# EAGLE schematic prototypeV2.32 (EAGLE 9.5.2)
DESIGNER: Juan J. Rojas / A. Wenzel; INSTITUTION: Kyutech (JP) / TEC (CR) / TUM (DE); PROJECT_NAME: BDC_Prototype; VERSION: 2.3
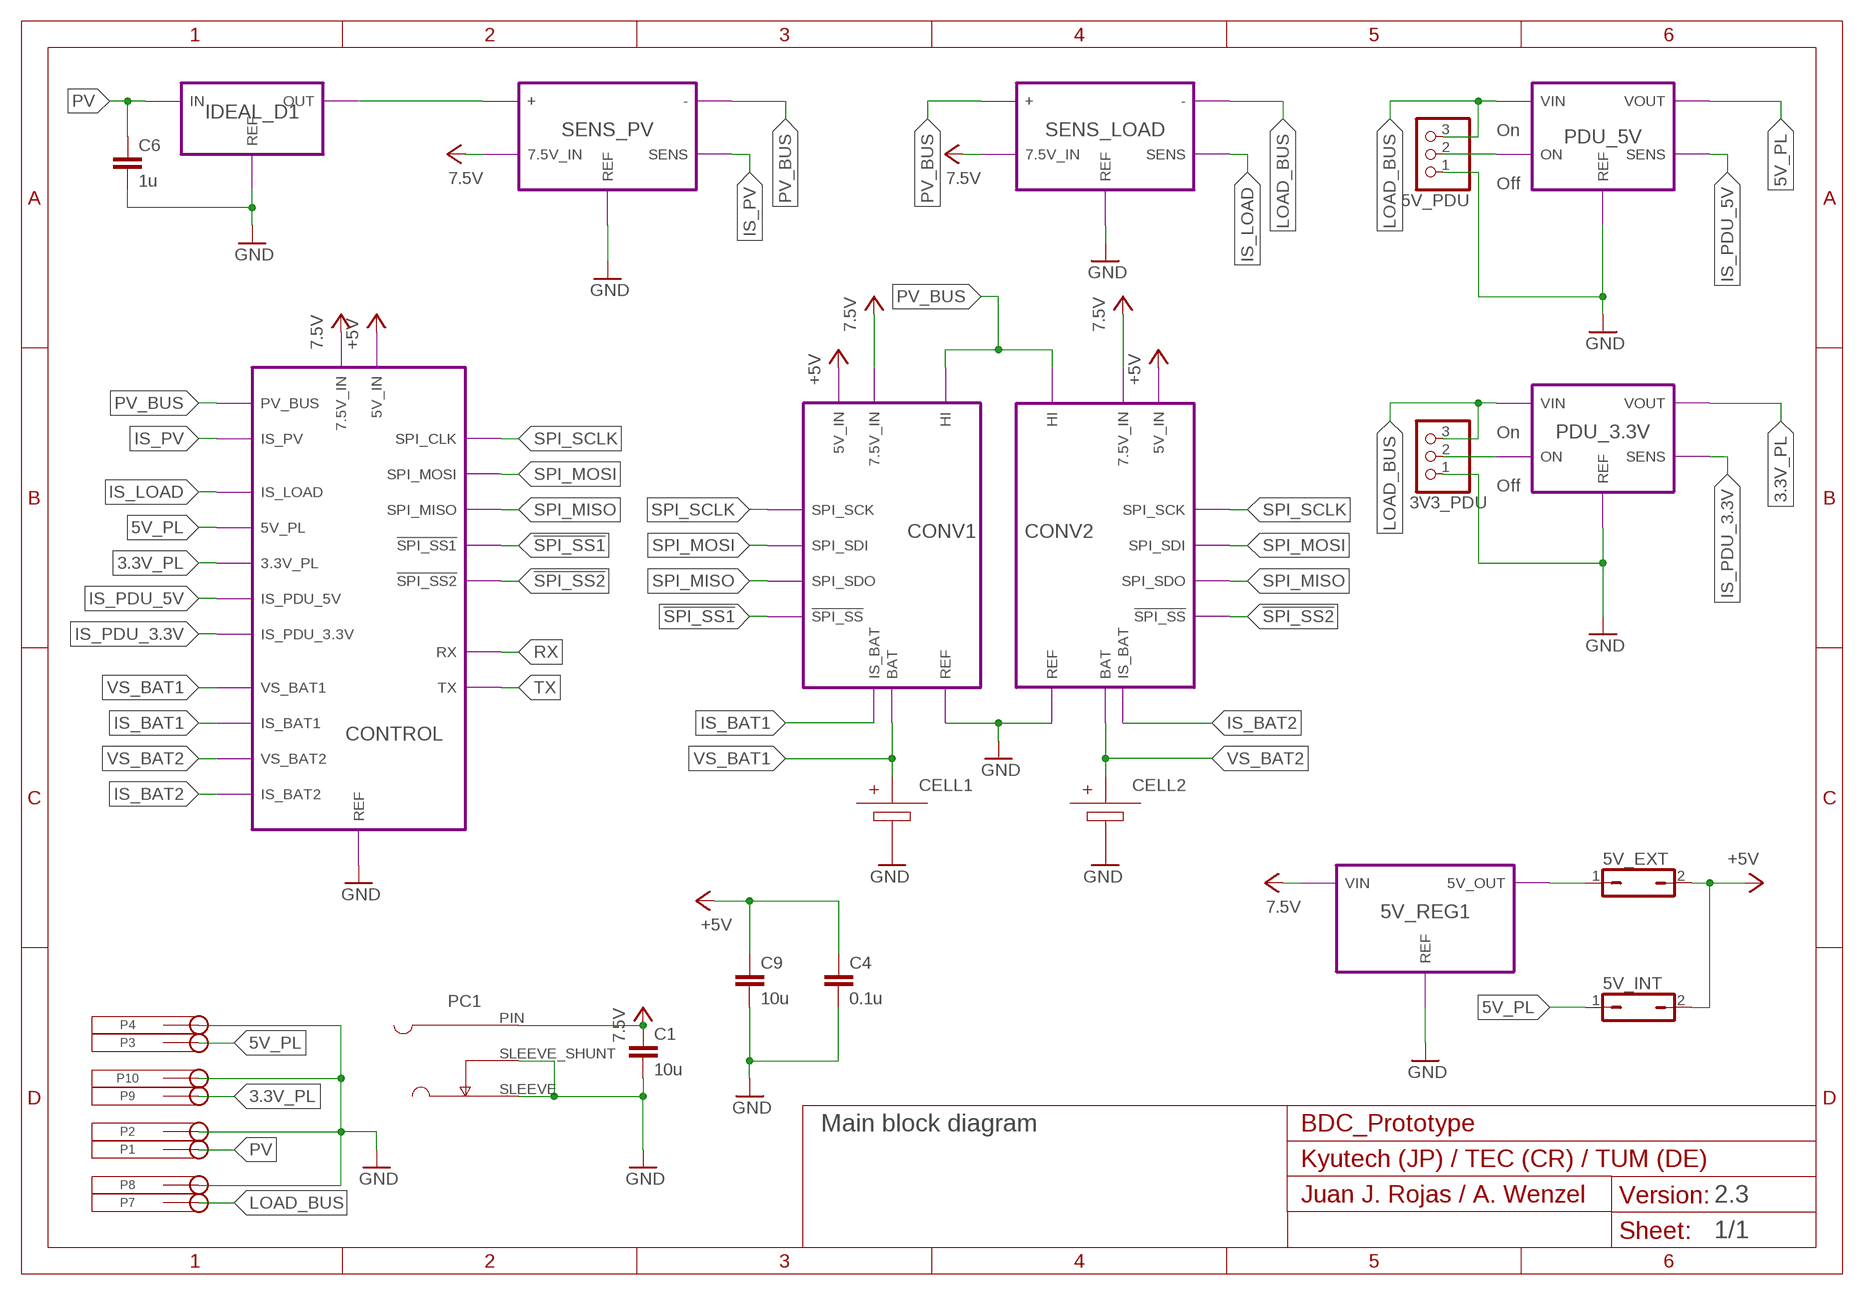
[diagram p0: schematic, sheet 1]
FRAME1 (A4L-JUANJO): TITLE: Main block diagram

## Parts
3V3_PDU  PINHD-1X3  [1X03]
5V_EXT  J2PSINGLE  [J2P]
5V_INT  J2PSINGLE  [J2P]
5V_PDU  PINHD-1X3  [1X03]
C1  10u  NONPOL_CAP-0603  [C0603]
C4  0.1u  NONPOL_CAP-0603  [C0603]
C6  1u  NONPOL_CAP-0603  [C0603]
C9  10u  NONPOL_CAP-0603  [C0603]
CELL1  CELL18650_HOLDER  [18650_HOLDER]
CELL2  CELL18650_HOLDER  [18650_HOLDER]
P1  TJ-563  [TJ-563]
P2  TJ-563  [TJ-563]
P3  TJ-563  [TJ-563]
P4  TJ-563  [TJ-563]
P7  TJ-563  [TJ-563]
P8  TJ-563  [TJ-563]
P9  TJ-563  [TJ-563]
P10  TJ-563  [TJ-563]
PC1  722RA  [722RA]

## Module instances
CONV1 = BIDIRECTIONAL_CONVERTER (part numbers offset by 100)
CONV2 = BIDIRECTIONAL_CONVERTER (part numbers offset by 200)
SENS_PV = BI_CURR_MEAS (part numbers offset by 500)
SENS_LOAD = BI_CURR_MEAS (part numbers offset by 600)
5V_REG1 = 5V_REGULATOR (part numbers offset by 800)
PDU_5V = POWER_DISTRIBUTION_UNIT_5V (part numbers offset by 900)
IDEAL_D1 = IDEAL_DIODE (part numbers offset by 1100)
PDU_3.3V = POWER_DISTRIBUTION_UNIT_3.3V (part numbers offset by 1200)
CONTROL = CONTROLLER (part numbers offset by 300)

## Nets
3.3V_PL: P9.P(PIN) ; port PDU_3.3V.VOUT CONTROL.3.3V_PL
5V_EXT: 5V_EXT.1 ; port 5V_REG1.5V_OUT
5V_ON: 5V_PDU.2 ; port PDU_5V.ON
5V_PL: 5V_INT.1 P3.P(PIN) ; port PDU_5V.VOUT CONTROL.5V_PL
7.5V: C1.1 PC1.PIN ; port SENS_PV.7.5V_IN SENS_LOAD.7.5V_IN 5V_REG1.VIN CONV1.7.5V_IN CONV2.7.5V_IN CONTROL.7.5V_IN
12V_ON: 3V3_PDU.2 ; port PDU_3.3V.ON
!SPI_SS1: port CONTROL.!SPI_SS1 CONV1.!SPI_SS
!SPI_SS2: port CONTROL.!SPI_SS2 CONV2.!SPI_SS
+5V: 5V_EXT.2 5V_INT.2 C4.1 C9.1 ; port CONV1.5V_IN CONV2.5V_IN CONTROL.5V_IN
GND: 3V3_PDU.1 5V_PDU.1 C1.2 C4.2 C6.2 C9.2 CELL1.BB1.N(-) CELL2.BB1.N(-) P2.P(PIN) P4.P(PIN) P8.P(PIN) P10.P(PIN) PC1.SLEEVE PC1.SLEEVE_SHUNT ; port SENS_PV.REF SENS_LOAD.REF PDU_5V.REF IDEAL_D1.REF PDU_3.3V.REF 5V_REG1.REF CONV1.REF CONV2.REF CONTROL.REF
IS_BAT1: port CONV1.IS_BAT CONTROL.IS_BAT1
IS_BAT2: port CONV2.IS_BAT CONTROL.IS_BAT2
IS_LOAD: port SENS_LOAD.SENS CONTROL.IS_LOAD
IS_PDU_3.3V: port CONTROL.IS_PDU_3.3V PDU_3.3V.SENS
IS_PDU_5V: port CONTROL.IS_PDU_5V PDU_5V.SENS
IS_PV: port SENS_PV.SENS CONTROL.IS_PV
LOAD_BUS: 3V3_PDU.3 5V_PDU.3 P7.P(PIN) ; port SENS_LOAD.- PDU_5V.VIN PDU_3.3V.VIN
N$6: port SENS_PV.+ IDEAL_D1.OUT
PV: C6.1 P1.P(PIN) ; port IDEAL_D1.IN
PV_BUS: port SENS_PV.- CONV2.HI CONV1.HI SENS_LOAD.+ CONTROL.PV_BUS
RX: port CONTROL.RX
SPI_MISO: port CONTROL.SPI_MISO CONV2.SPI_SDO CONV1.SPI_SDO
SPI_MOSI: port CONTROL.SPI_MOSI CONV1.SPI_SDI CONV2.SPI_SDI
SPI_SCLK: port CONTROL.SPI_CLK CONV1.SPI_SCK CONV2.SPI_SCK
TX: port CONTROL.TX
VS_BAT1: CELL1.BB1.P(+) ; port CONV1.BAT CONTROL.VS_BAT1
VS_BAT2: CELL2.BB1.P(+) ; port CONV2.BAT CONTROL.VS_BAT2

## Notes on the sheet
- On
- Off
- On
- Off

## Library data of the parts
3V3_PDU 5V_PDU = pinhead:PINHD-1X3: PIN HEADER
5V_EXT 5V_INT = Interfaces:J2P: JUMPER
C1 C4 C6 C9 = Pasives:NONPOL_CAP
CELL1 CELL2 = Sources:CELL
P1-P4 P7-P10 = Interfaces:TJ-563
PC1 = Interfaces:722RA

## Module BIDIRECTIONAL_CONVERTER
Ports: BAT(io) 7.5V_IN(pwr) 5V_IN(pwr) HI(pwr) REF(pwr) IS_BAT(out) !SPI_SS(in) SPI_SDO(out) SPI_SDI(in) SPI_SCK(in)
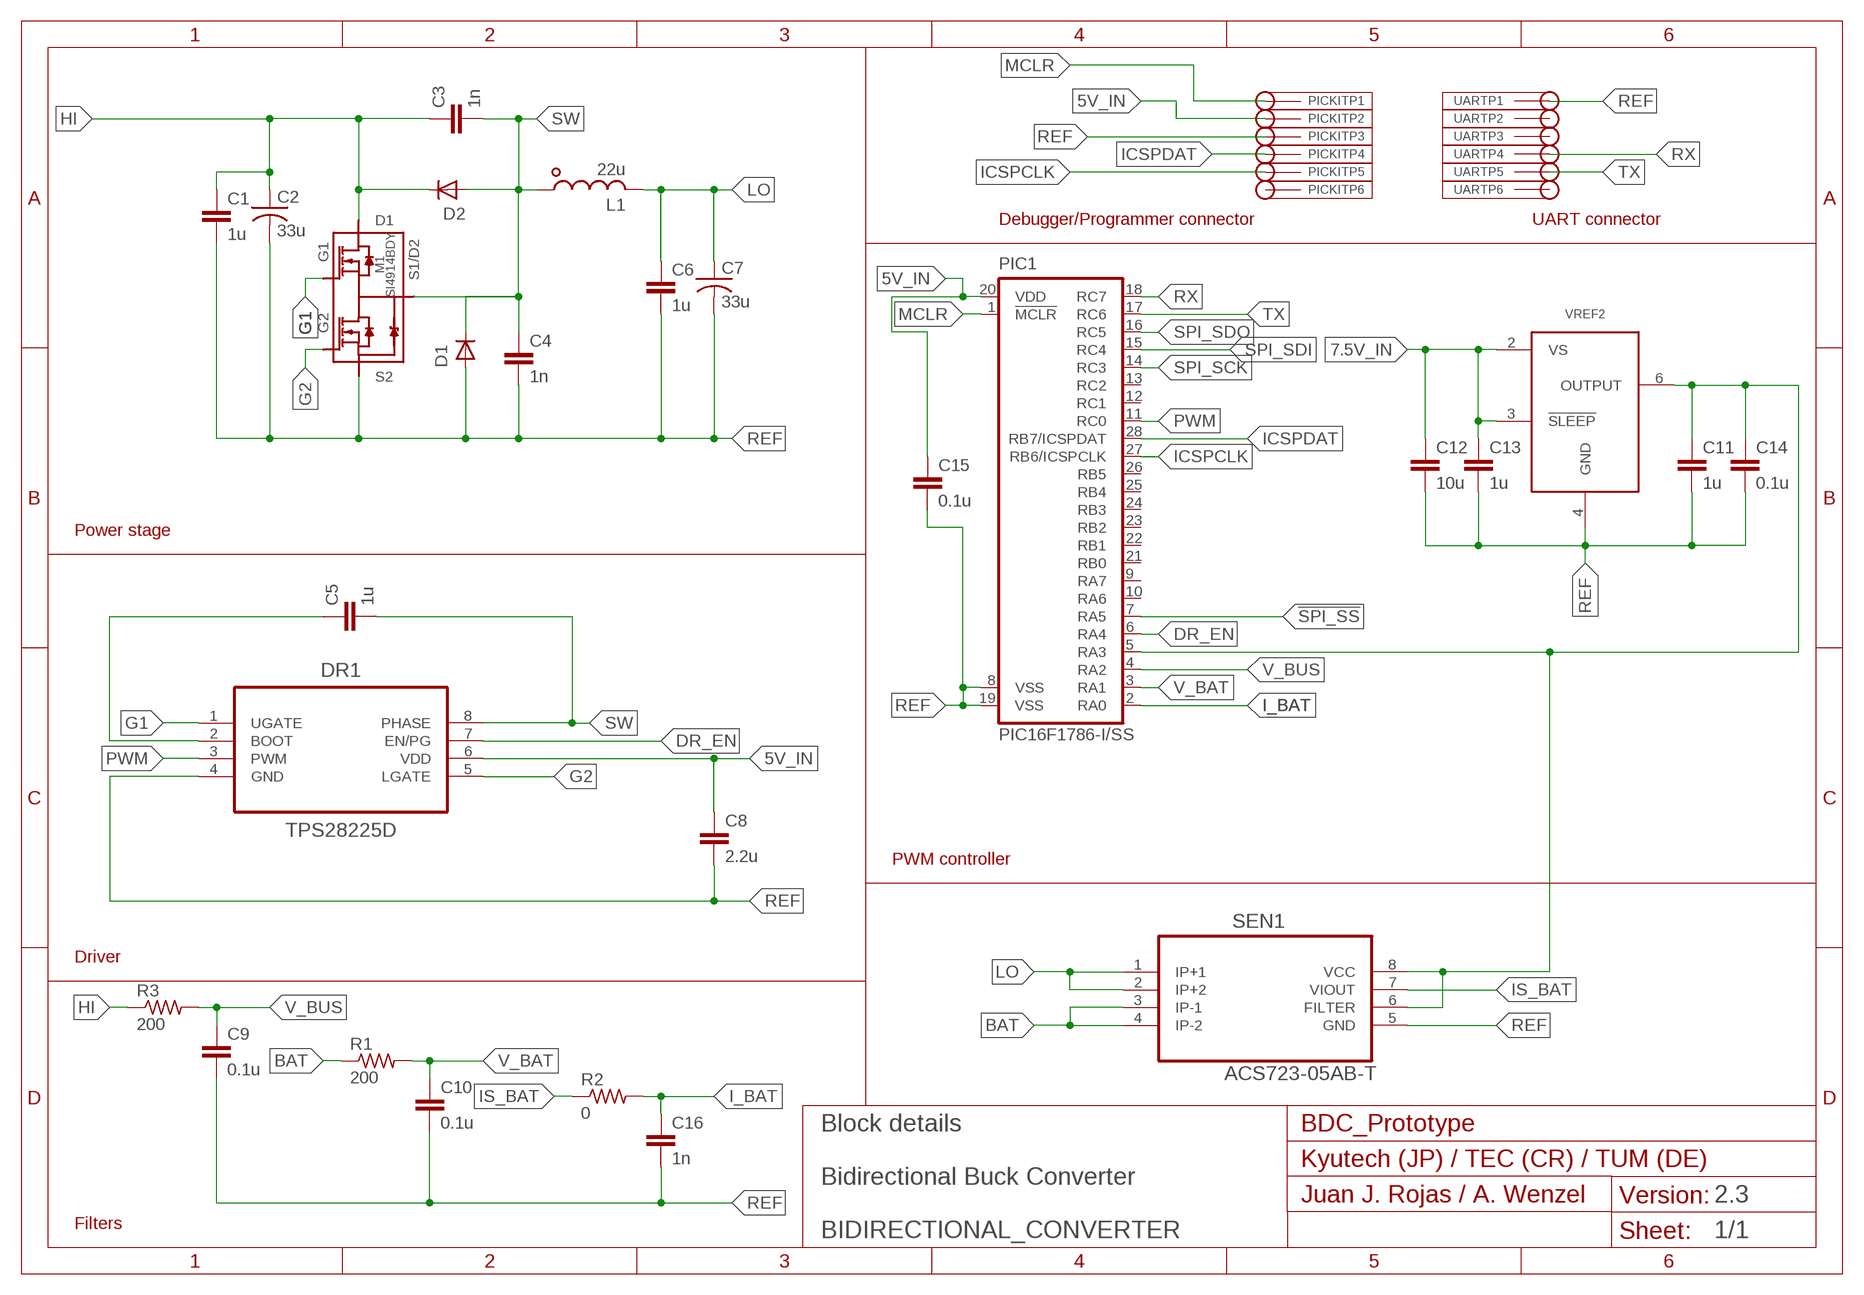
[diagram p1: schematic, module BIDIRECTIONAL_CONVERTER, sheet 1]
FRAME1 (A4L-JUANJO): SUBTITLE: Bidirectional Buck Converter; TITLE: Block details

### Parts
C1  1u  NONPOL_CAP-0603  [C0603]
C2  33u  POL_CAP-7343  [C7343]
C3  1n  NONPOL_CAP-0603  [C0603]
C4  1n  NONPOL_CAP-0603  [C0603]
C5  1u  NONPOL_CAP-0603  [C0603]
C6  1u  NONPOL_CAP-0603  [C0603]
C7  33u  POL_CAP-7343  [C7343]
C8  2.2u  NONPOL_CAP-0603  [C0603]
C9  0.1u  NONPOL_CAP-0603  [C0603]
C10  0.1u  NONPOL_CAP-0603  [C0603]
C11  1u  NONPOL_CAP-0603  [C0603]
C12  10u  NONPOL_CAP-0603  [C0603]
C13  1u  NONPOL_CAP-0603  [C0603]
C14  0.1u  NONPOL_CAP-0603  [C0603]
C15  0.1u  NONPOL_CAP-0603  [C0603]
C16  1n  NONPOL_CAP-0603  [C0603]
D1  BAQ133  DIODE-SMB  [SMB]
D2  BAQ133  DIODE-SMB  [SMB]
DR1  TPS28225D  [SOIC-8]
L1  22u  INDUCTOR-CLF12555  [CLF12555]
M1  SI4914BDY  [SOIC-8]
PIC1  PIC16F1786-I/SS  [SSOP28]
PICKIT  MA06-1  [MA06-1]
R1  200  RESISTOR-0603  [R0603]
R2  0  RESISTOR-0603  [R0603]
R3  200  RESISTOR-0603  [R0603]
SEN1  ACS723-05AB-T  [SOIC-8]
UART  MA06-1  [MA06-1]
VREF2  REF195GSZ  [SOIC-8]

### Nets
5V_IN: C8.1 C15.1 DR1.6(VDD) PIC1.20(VDD) PICKIT.2
5V_REF: C11.1 C14.1 PIC1.5(RA3) SEN1.6(FILTER) SEN1.8(VCC) VREF2.6(OUTPUT)
7.5V_IN: C12.1 C13.1 VREF2.2(VS) VREF2.3(!SLEEP!)
!SPI_SS: PIC1.7(RA5)
BAT: R1.1 SEN1.3(IP-1) SEN1.4(IP-2)
DR_EN: DR1.7(EN/PG) PIC1.6(RA4)
G1: DR1.1(UGATE) M1.8(G1)
G2: DR1.5(LGATE) M1.3(G2)
HI: C1.1 C2.+ C3.1 D2.C M1.1(D1) M1.2(D1) R3.1
I_BAT: C16.1 PIC1.2(RA0) R2.2
ICSPCLK: PIC1.27(RB6/ICSPCLK) PICKIT.5
ICSPDAT: PIC1.28(RB7/ICSPDAT) PICKIT.4
IS_BAT: R2.1 SEN1.7(VIOUT)
LO: C6.1 C7.+ L1.2 SEN1.1(IP+1) SEN1.2(IP+2)
MCLR: PIC1.1(!MCLR) PICKIT.1
N$2: C5.1 DR1.2(BOOT)
PWM: DR1.3(PWM) PIC1.11(RC0)
REF: C1.2 C2.- C4.2 C6.2 C7.- C8.2 C9.2 C10.2 C11.2 C12.2 C13.2 C14.2 C15.2 C16.2 D1.A DR1.4(GND) M1.4(S2) PIC1.8(VSS) PIC1.19(VSS) PICKIT.3 SEN1.5(GND) UART.1 VREF2.4(GND)
RX: PIC1.18(RC7) UART.4
SPI_SCK: PIC1.14(RC3)
SPI_SDI: PIC1.15(RC4)
SPI_SDO: PIC1.16(RC5)
SW: C3.2 C4.1 C5.2 D1.C D2.A DR1.8(PHASE) L1.1 M1.5(S1/D2) M1.6(S1/D2) M1.7(S1/D2)
TX: PIC1.17(RC6) UART.5
V_BAT: C10.1 PIC1.3(RA1) R1.2
V_BUS: C9.1 PIC1.4(RA2) R3.2
Unconnected: PIC1.9(RA7) PIC1.10(RA6) PIC1.12(RC1) PIC1.13(RC2) PIC1.21(RB0) PIC1.22(RB1) PIC1.23(RB2) PIC1.24(RB3) PIC1.25(RB4) PIC1.26(RB5) PICKIT.6 UART.2 UART.3 UART.6

### Notes on the sheet
- Debugger/Programmer connector | UART connector
- Power stage
- PWM controller
- Driver
- Filters

### Library data of the parts
C1 C3-C6 C8-C16 = Pasives:NONPOL_CAP
C2 C7 = Pasives:POL_CAP
D1 D2 = Pasives:DIODE
DR1 = ICs:TPS28225D
L1 = Pasives:INDUCTOR: SMD Power Inductor
M1 = ICs:SI4914BDY
PIC1 = ICs:PIC16F1786
PICKIT UART = Interfaces:MA06-1: PIN HEADER; OC_FARNELL: unknown; OC_NEWARK: unknown
R1-R3 = Pasives:RESISTOR: RESISTOR
SEN1 = ICs:ACS723-05AB-T: Hall Effect-Based Linear Current Sensor IC - 5A
VREF2 = ICs:REF195GSZ

## Module BI_CURR_MEAS
Ports: REF(pwr) +(io) -(io) SENS(io) 7.5V_IN(pwr)
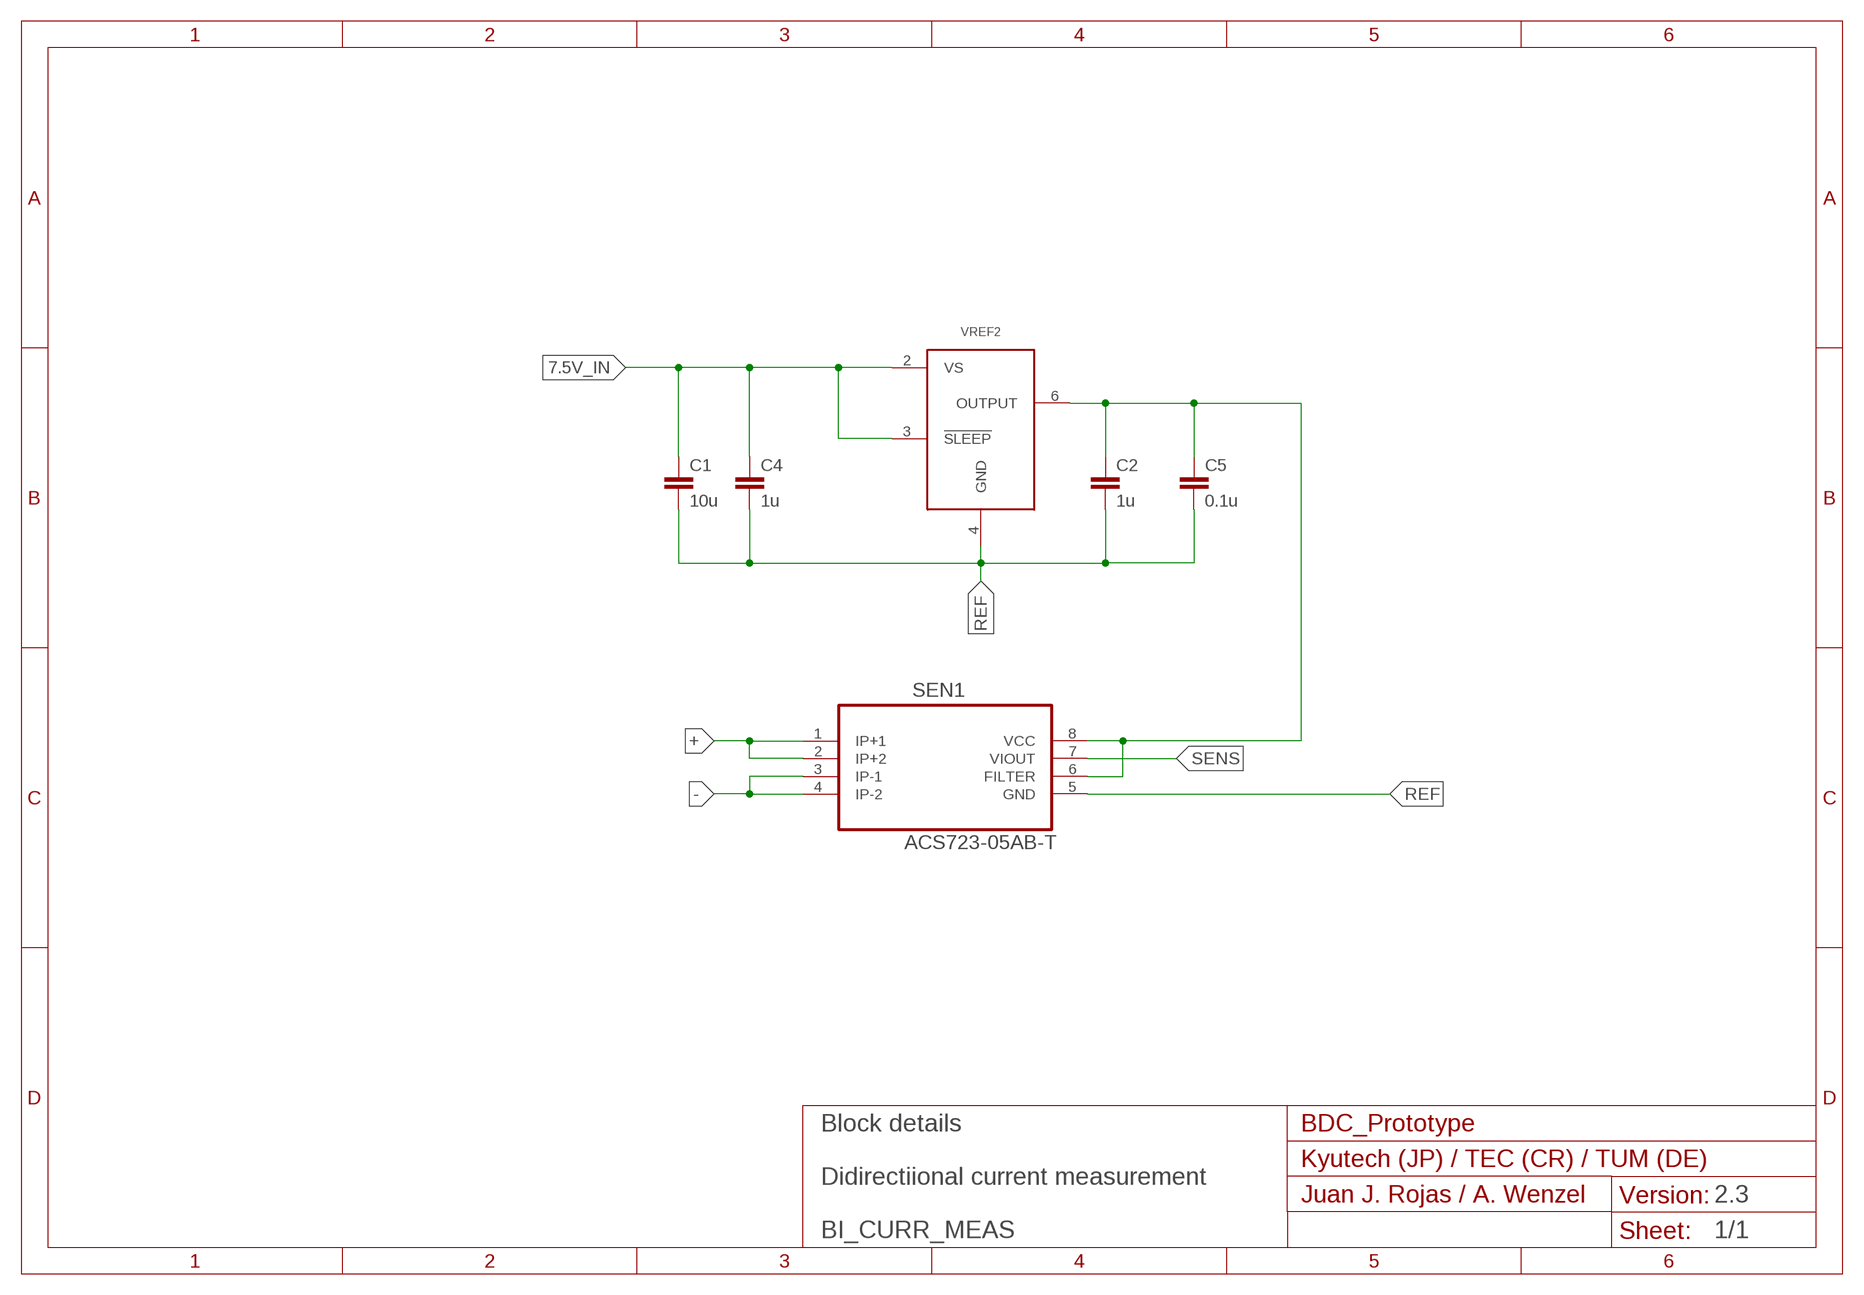
[diagram p2: schematic, module BI_CURR_MEAS, sheet 1]
FRAME2 (A4L-JUANJO): SUBTITLE: Didirectiional current measurement; TITLE: Block details

### Parts
C1  10u  NONPOL_CAP-0603  [C0603]
C2  1u  NONPOL_CAP-0603  [C0603]
C4  1u  NONPOL_CAP-0603  [C0603]
C5  0.1u  NONPOL_CAP-0603  [C0603]
SEN1  ACS723-05AB-T  [SOIC-8]
VREF2  REF195GSZ  [SOIC-8]

### Nets
5V_REF: C2.1 C5.1 SEN1.6(FILTER) SEN1.8(VCC) VREF2.6(OUTPUT)
7.5V_IN: C1.1 C4.1 VREF2.2(VS) VREF2.3(!SLEEP!)
+: SEN1.1(IP+1) SEN1.2(IP+2)
-: SEN1.3(IP-1) SEN1.4(IP-2)
REF: C1.2 C2.2 C4.2 C5.2 SEN1.5(GND) VREF2.4(GND)
SENS: SEN1.7(VIOUT)

### Library data of the parts
C1 C2 C4 C5 = Pasives:NONPOL_CAP
SEN1 = ICs:ACS723-05AB-T: Hall Effect-Based Linear Current Sensor IC - 5A
VREF2 = ICs:REF195GSZ

## Module 5V_REGULATOR
Ports: 5V_OUT(io) VIN(pwr) REF(pwr)
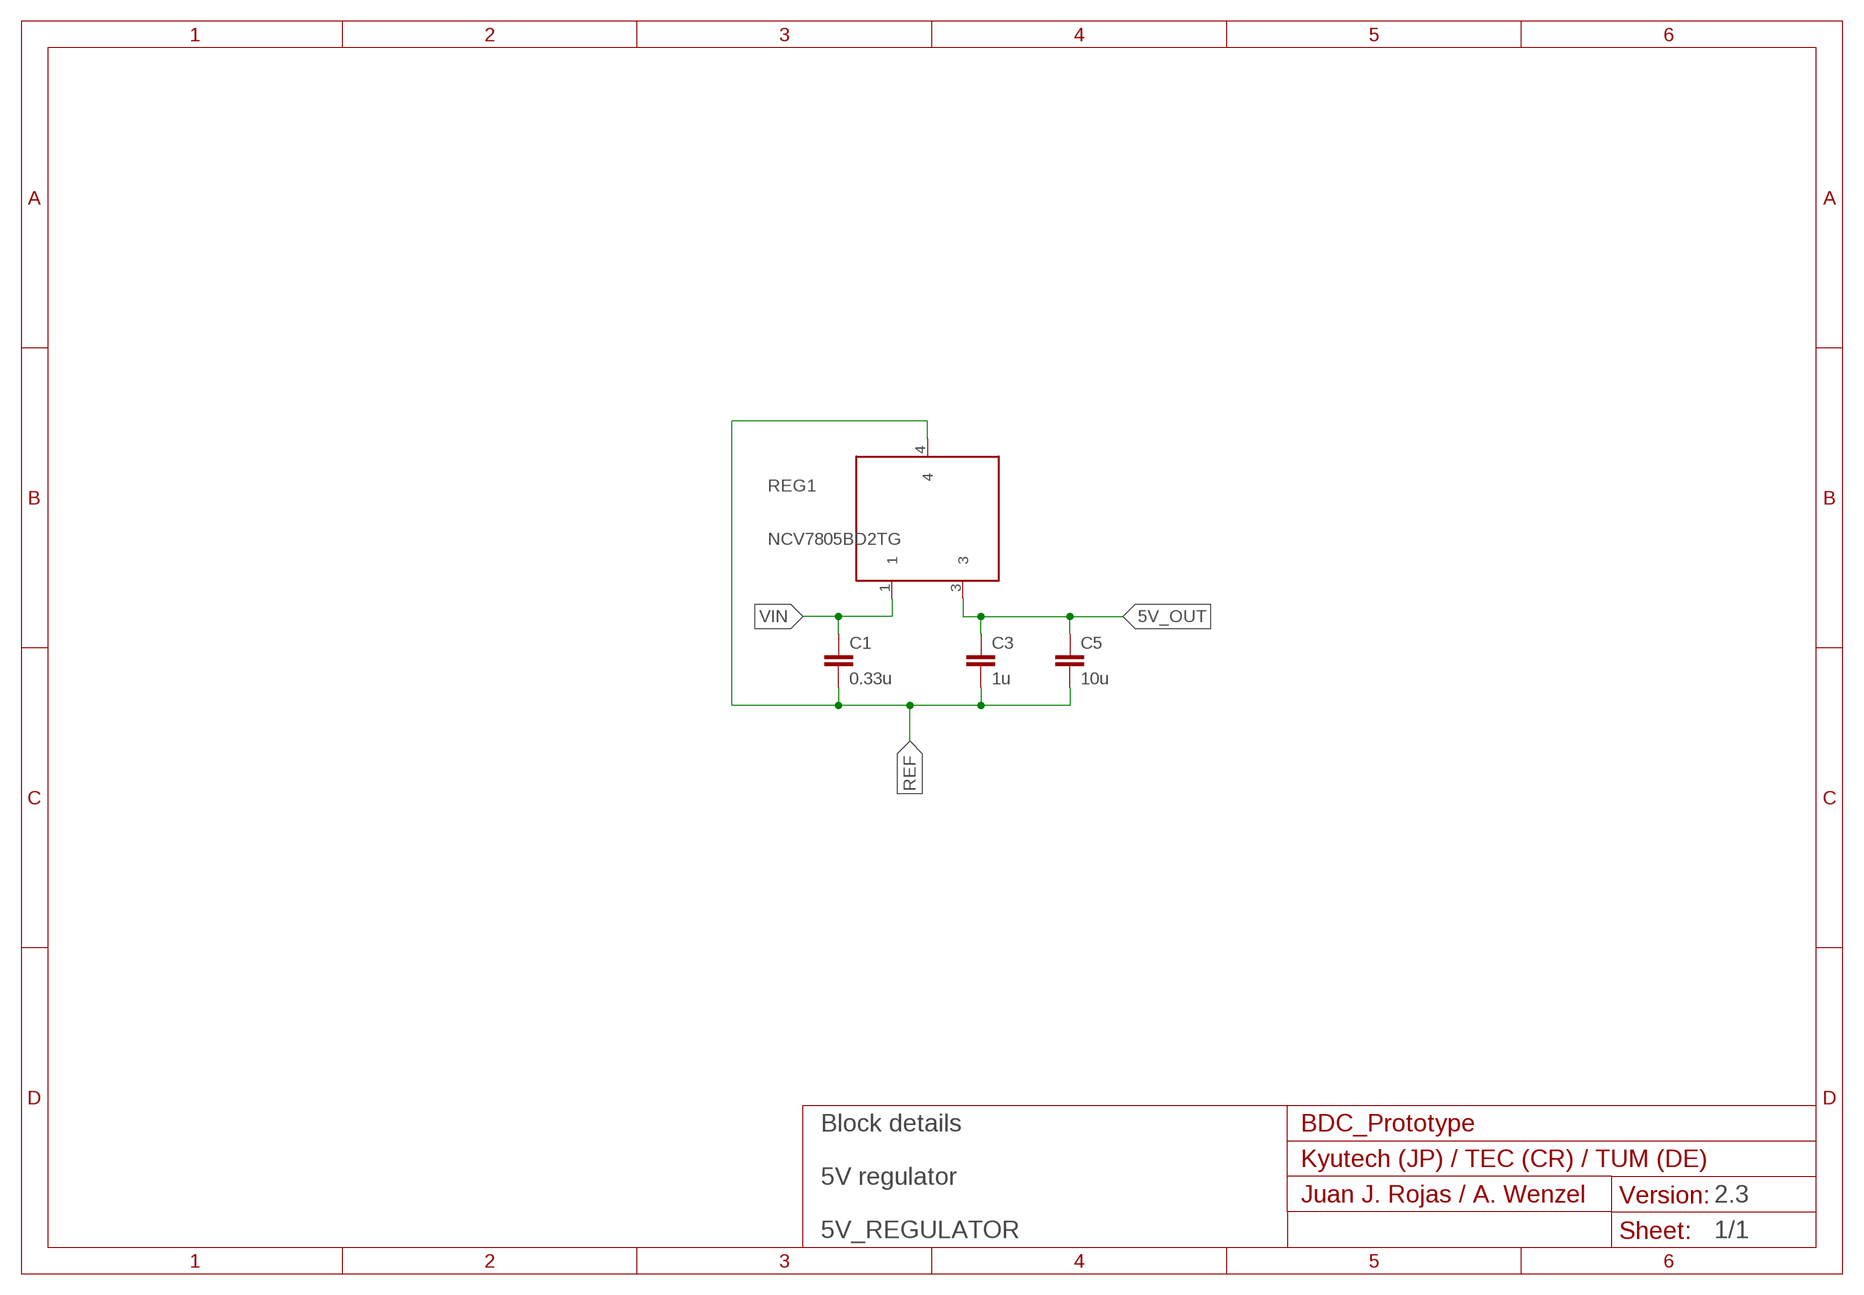
[diagram p3: schematic, module 5V_REGULATOR, sheet 1]
FRAME2 (A4L-JUANJO): SUBTITLE: 5V regulator; TITLE: Block details

### Parts
C1  0.33u  NONPOL_CAP-0603  [C0603]
C3  1u  NONPOL_CAP-0603  [C0603]
C5  10u  NONPOL_CAP-0603  [C0603]
REG1  NCV7805BD2TG  [D2PAK-3]

### Nets
5V_OUT: C3.1 C5.1 REG1.3
REF: C1.2 C3.2 C5.2 REG1.4
VIN: C1.1 REG1.1

### Library data of the parts
C1 C3 C5 = Pasives:NONPOL_CAP
REG1 = ICs:NCV7805BD2TG

## Module POWER_DISTRIBUTION_UNIT_5V
Ports: VIN(io) VOUT(io) SENS(io) ON(io) REF(pwr)
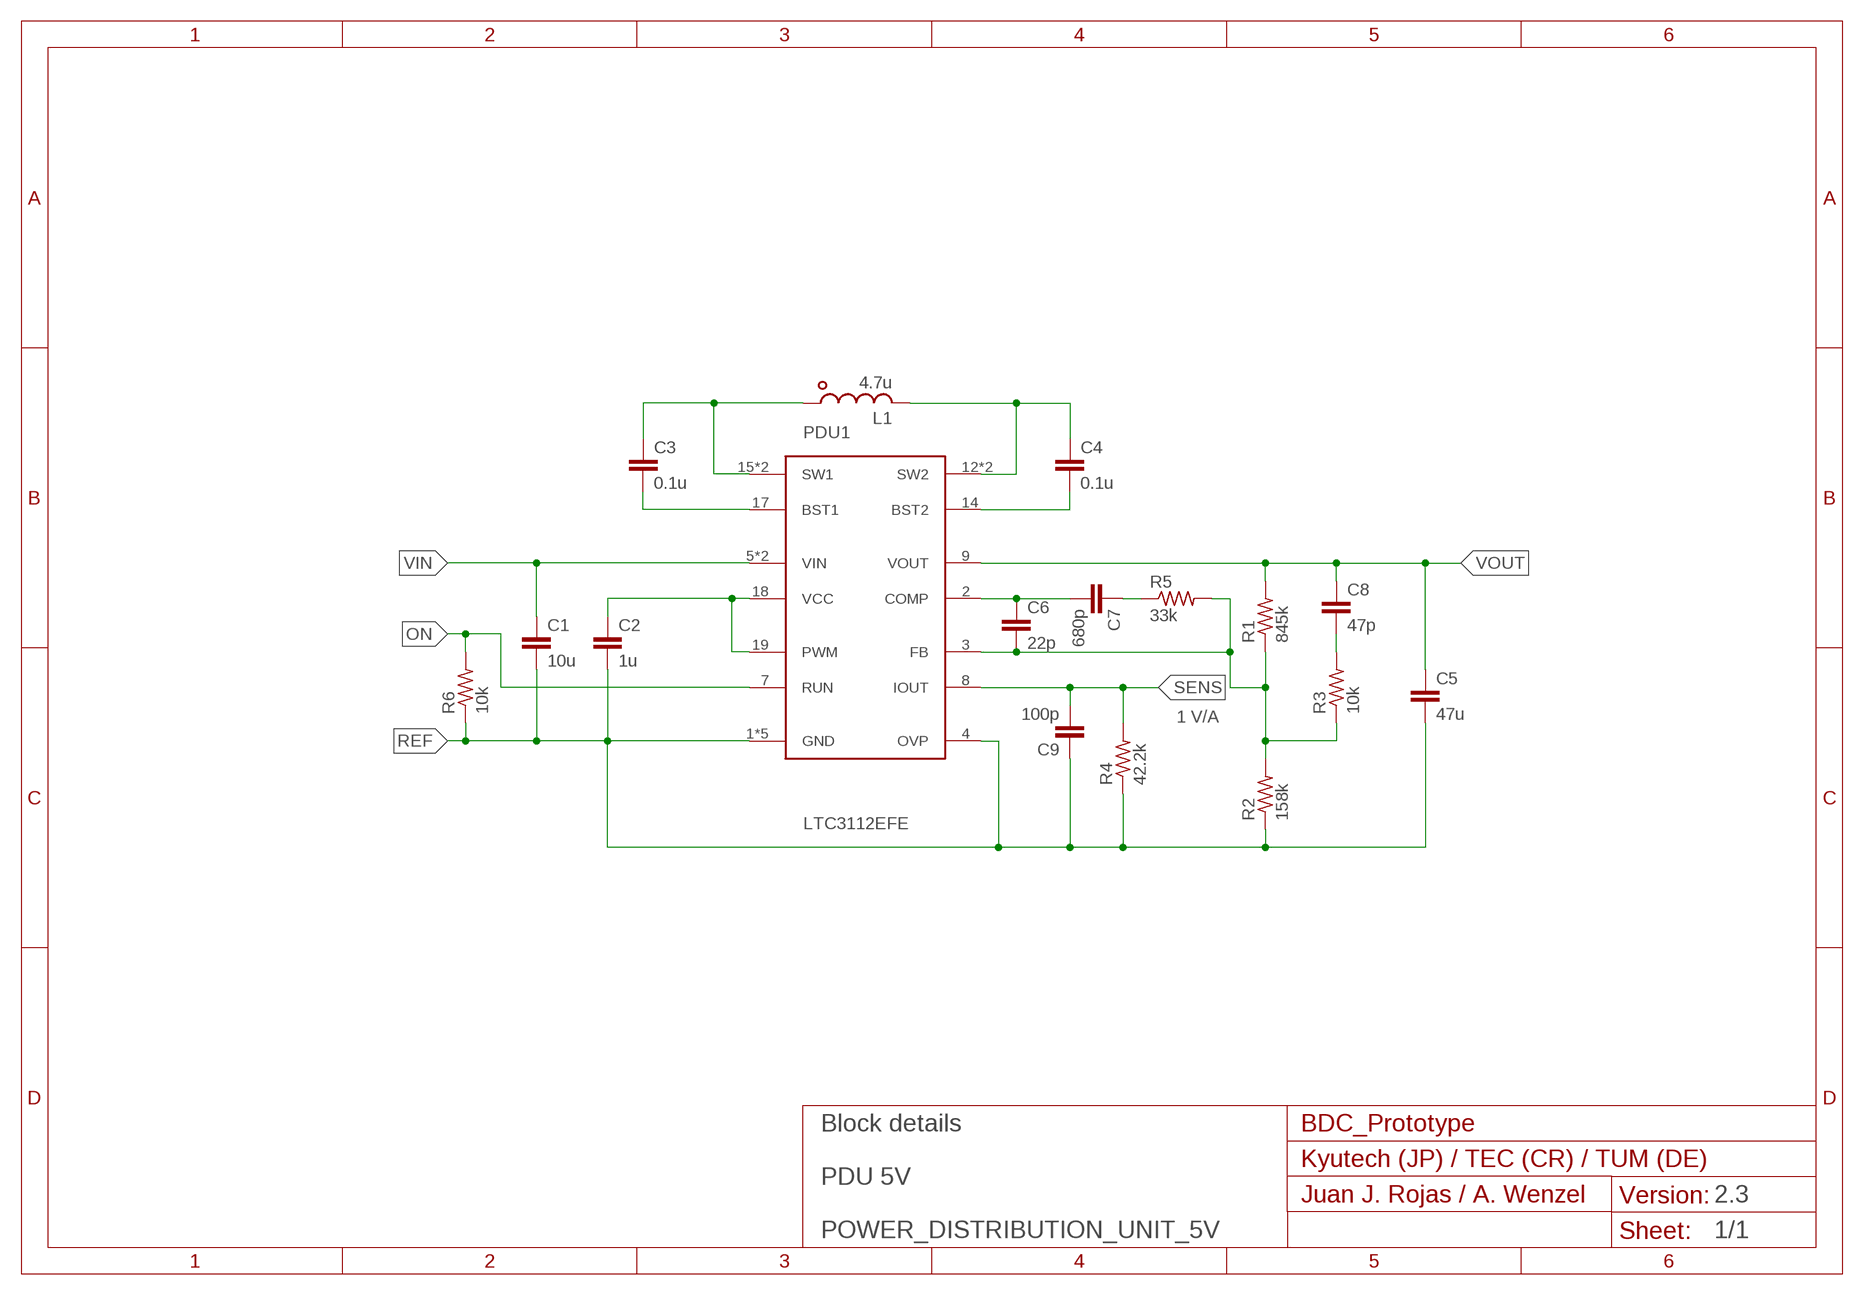
[diagram p4: schematic, module POWER_DISTRIBUTION_UNIT_5V, sheet 1]
FRAME2 (A4L-JUANJO): SUBTITLE: PDU 5V; TITLE: Block details

### Parts
C1  10u  NONPOL_CAP-0603  [C0603]
C2  1u  NONPOL_CAP-0603  [C0603]
C3  0.1u  NONPOL_CAP-0603  [C0603]
C4  0.1u  NONPOL_CAP-0603  [C0603]
C5  47u  NONPOL_CAP-1210  [C1210]
C6  22p  NONPOL_CAP-0603  [C0603]
C7  680p  NONPOL_CAP-0603  [C0603]
C8  47p  NONPOL_CAP-0603  [C0603]
C9  100p  NONPOL_CAP-0603  [C0603]
L1  4.7u  INDUCTOR-SPM4020T  [SPM4020T]
PDU1  LTC3112EFE  [TSSOP20CA]
R1  845k  RESISTOR-0603  [R0603]
R2  158k  RESISTOR-0603  [R0603]
R3  10k  RESISTOR-0603  [R0603]
R4  42.2k  RESISTOR-0603  [R0603]
R5  33k  RESISTOR-0603  [R0603]
R6  10k  RESISTOR-0603  [R0603]

### Nets
N$1: C3.2 PDU1.17(BST1)
N$2: C2.1 PDU1.18(VCC) PDU1.19(PWM)
N$3: C4.2 PDU1.14(BST2)
N$4: C3.1 L1.1 PDU1.15(SW1) PDU1.16(SW1)
N$5: C7.1 R5.1
N$6: C6.1 C7.2 PDU1.2(COMP)
N$7: C4.1 L1.2 PDU1.12(SW2) PDU1.13(SW2)
N$8: C8.2 R3.2
N$9: C6.2 PDU1.3(FB) R1.1 R2.2 R3.1 R5.2
ON: PDU1.7(RUN) R6.2
REF: C1.2 C2.2 C5.2 C9.1 PDU1.1(GND) PDU1.4(OVP) PDU1.10(GND) PDU1.11(GND) PDU1.20(GND) PDU1.21(GND) R2.1 R4.1 R6.1
SENS: C9.2 PDU1.8(IOUT) R4.2
VIN: C1.1 PDU1.5(VIN) PDU1.6(VIN)
VOUT: C5.1 C8.1 PDU1.9(VOUT) R1.2

### Notes on the sheet
- 1 V/A

### Library data of the parts
C1-C9 = Pasives:NONPOL_CAP
L1 = Pasives:INDUCTOR: SMD Power Inductor
PDU1 = ICs:LTC3112
R1-R6 = Pasives:RESISTOR: RESISTOR

## Module IDEAL_DIODE
Ports: IN(io) OUT(io) REF(pwr)
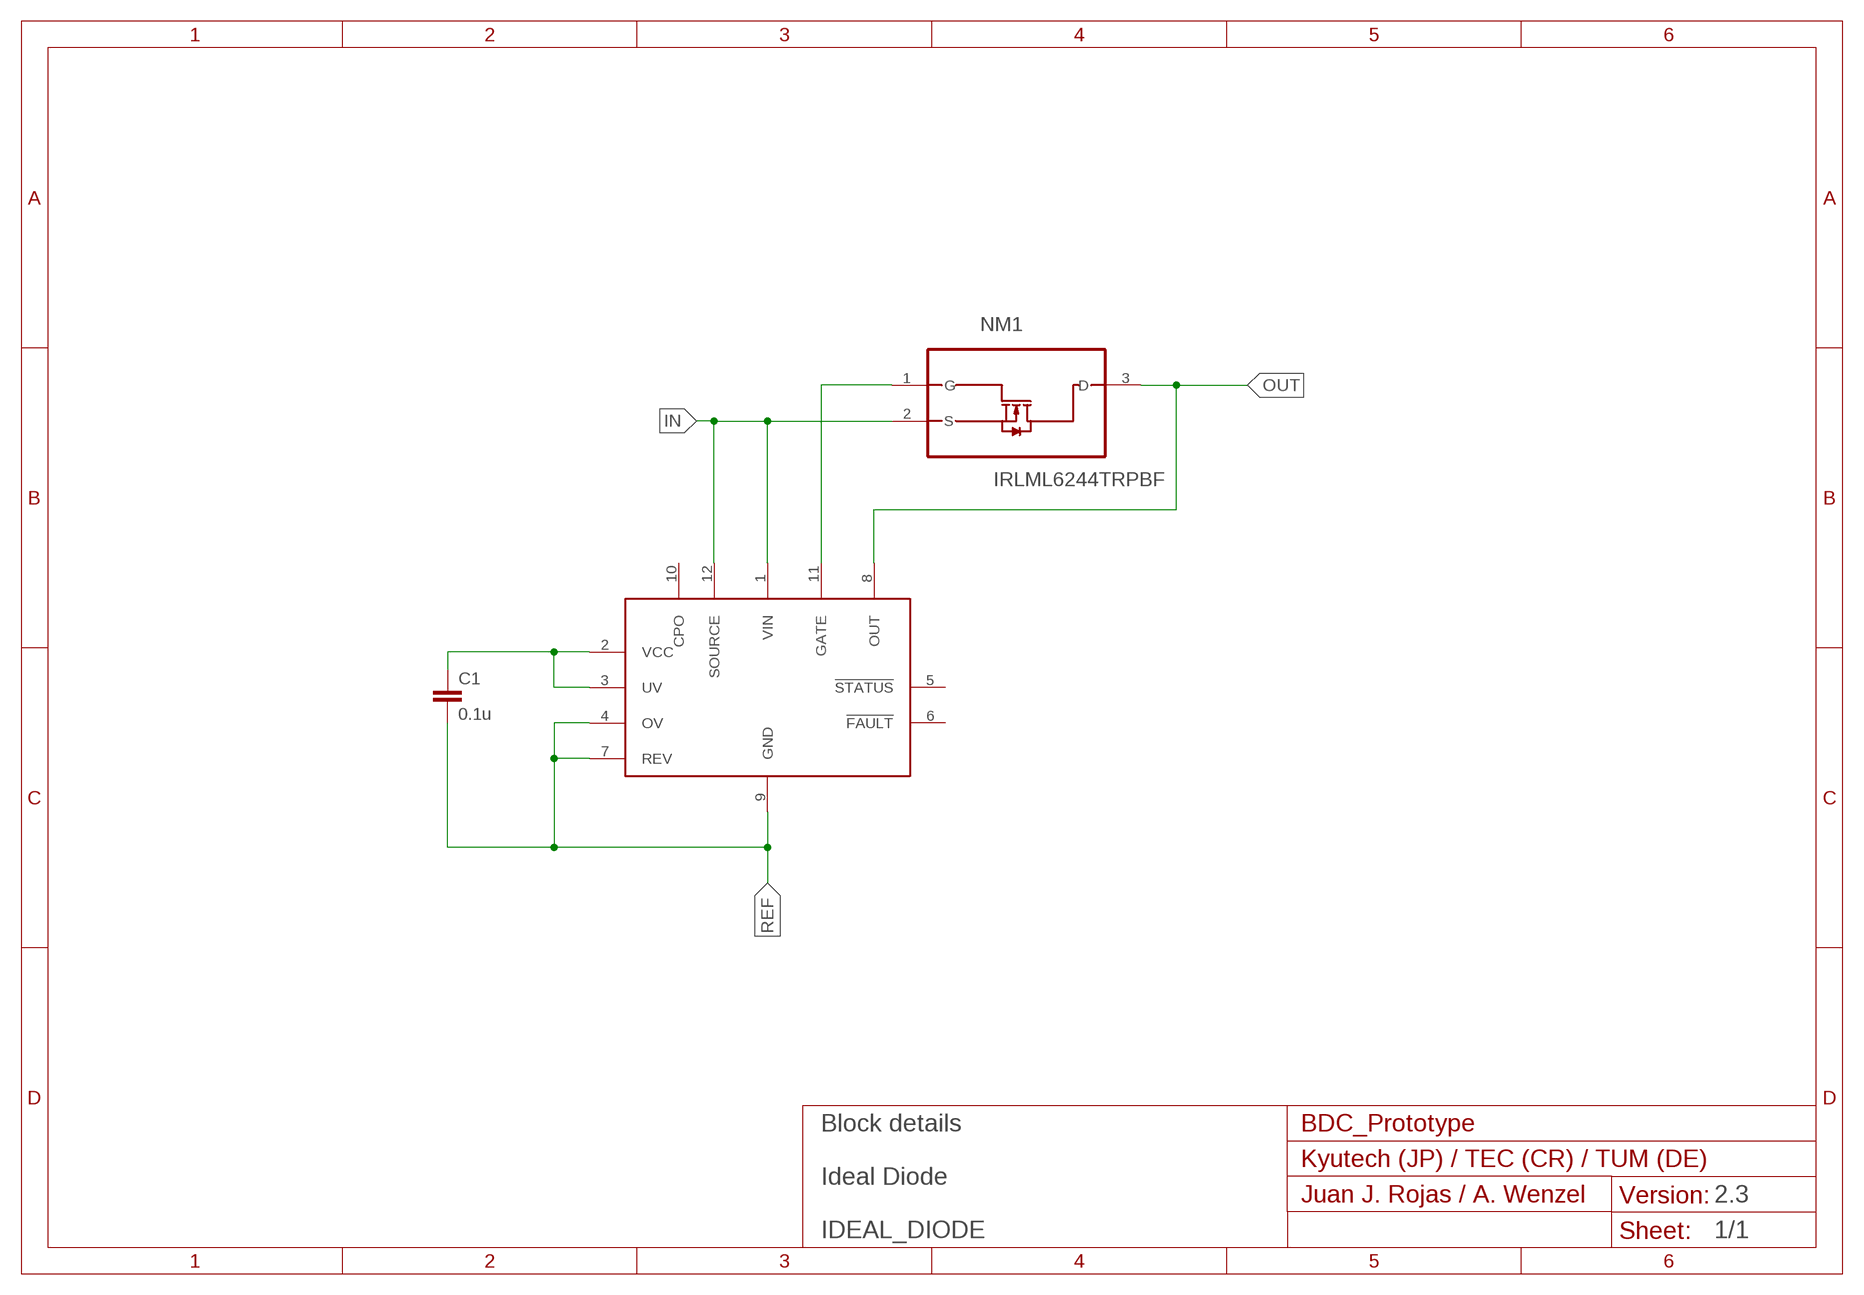
[diagram p5: schematic, module IDEAL_DIODE, sheet 1]
FRAME2 (A4L-JUANJO): SUBTITLE: Ideal Diode; TITLE: Block details

### Parts
C1  0.1u  NONPOL_CAP-0603  [C0603]
IDD1  LTC4352CMS  [MSOP12]
NM1  IRLML6244TRPBF  [SOT-23]

### Nets
IN: IDD1.1(VIN) IDD1.12(SOURCE) NM1.2(S)
N$1: IDD1.11(GATE) NM1.1(G)
N$4: C1.1 IDD1.2(VCC) IDD1.3(UV)
OUT: IDD1.8(OUT) NM1.3(D)
REF: C1.2 IDD1.4(OV) IDD1.7(REV) IDD1.9(GND)
Unconnected: IDD1.5(!STATUS) IDD1.6(!FAULT) IDD1.10(CPO)

### Library data of the parts
C1 = Pasives:NONPOL_CAP
IDD1 = ICs:LTC4352
NM1 = ICs:IRLML6244TRPBF: N-channel MOSFET, 6.3 A, 20 V HEXFET; RS_SN: 737-7228

## Module POWER_DISTRIBUTION_UNIT_3.3V
Ports: VIN(io) VOUT(io) ON(io) SENS(io) REF(io)
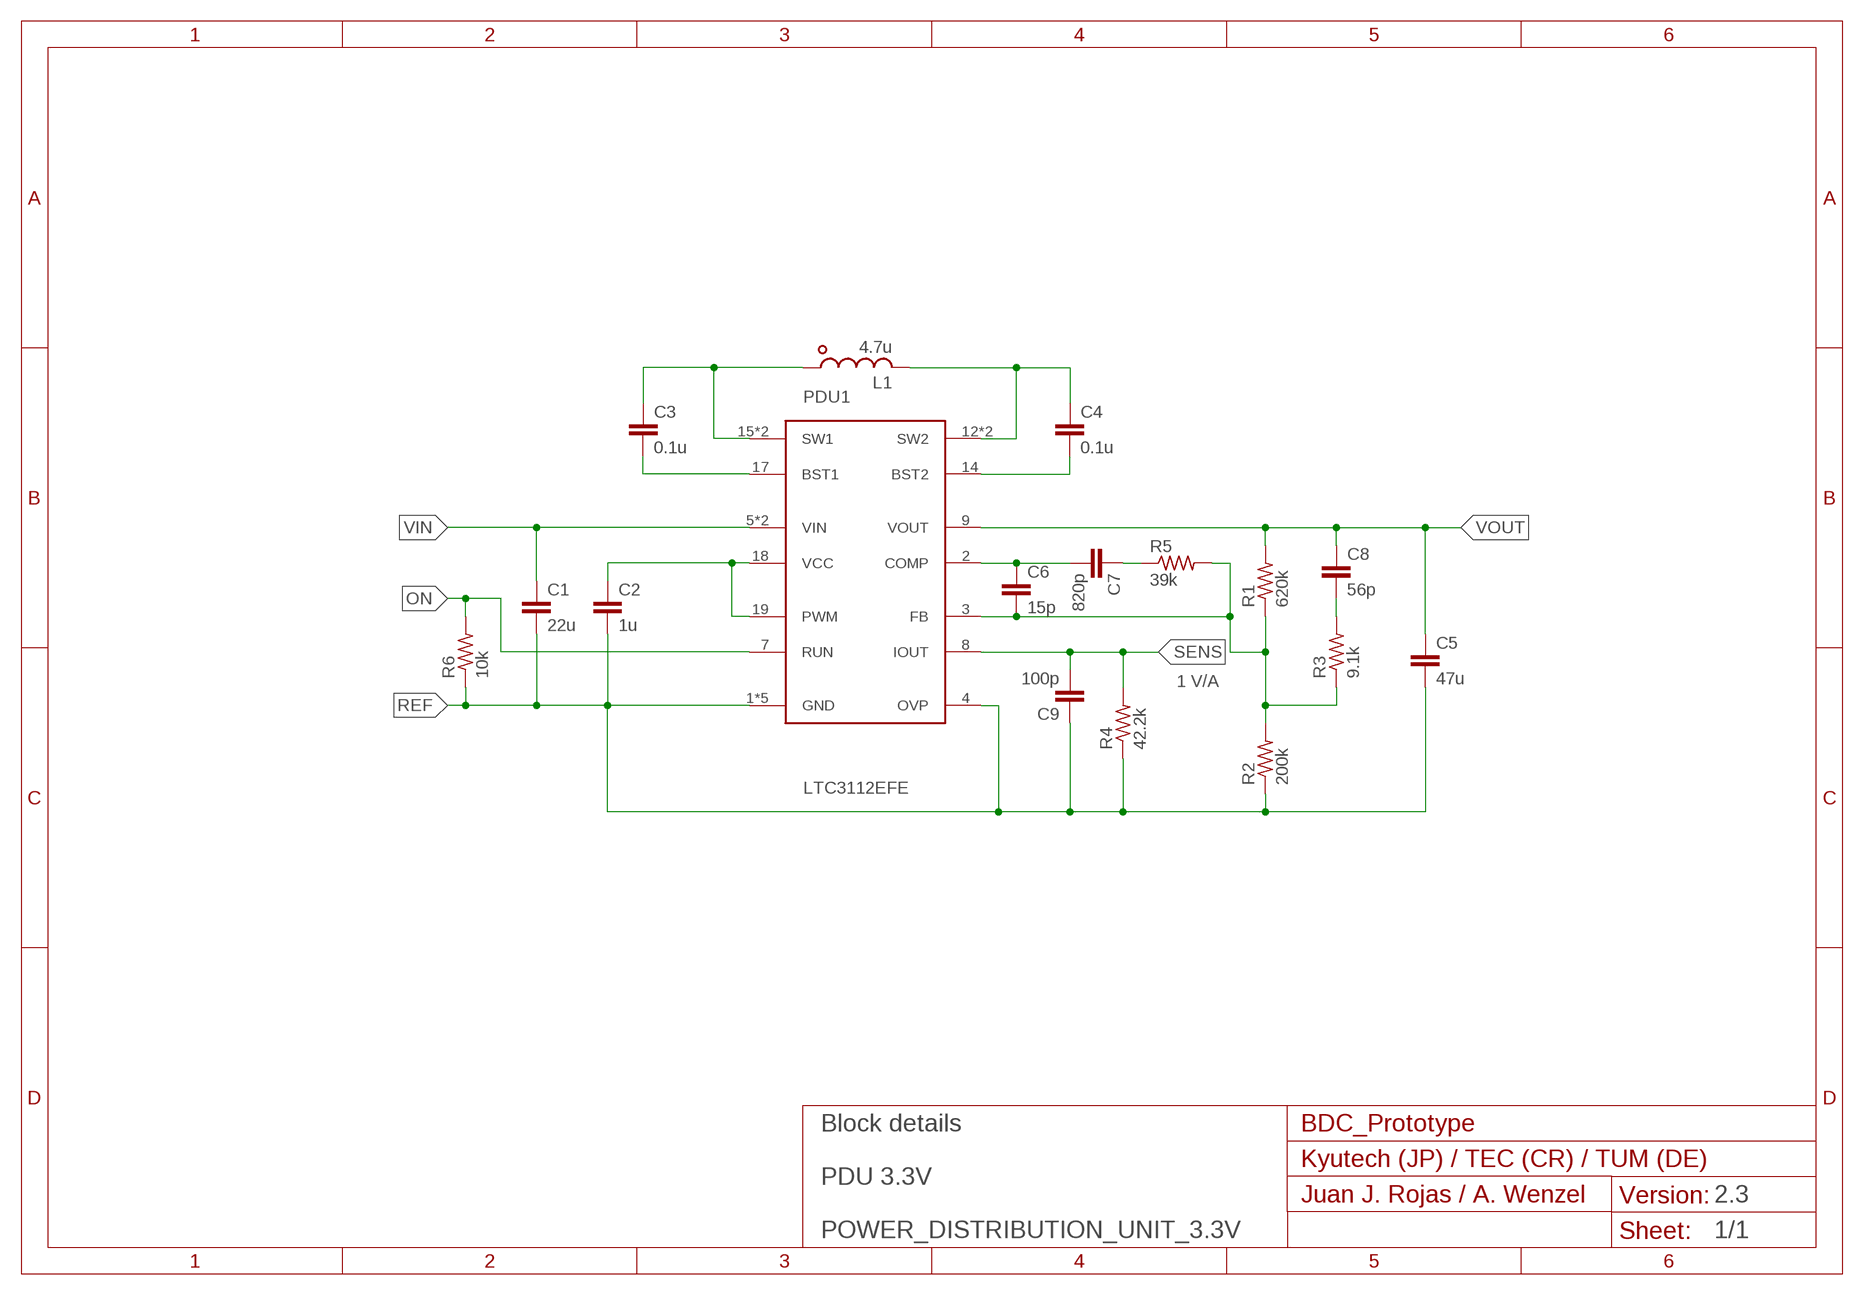
[diagram p6: schematic, module POWER_DISTRIBUTION_UNIT_3.3V, sheet 1]
FRAME2 (A4L-JUANJO): SUBTITLE: PDU 3.3V; TITLE: Block details

### Parts
C1  22u  NONPOL_CAP-0603  [C0603]
C2  1u  NONPOL_CAP-0603  [C0603]
C3  0.1u  NONPOL_CAP-0603  [C0603]
C4  0.1u  NONPOL_CAP-0603  [C0603]
C5  47u  NONPOL_CAP-1210  [C1210]
C6  15p  NONPOL_CAP-0603  [C0603]
C7  820p  NONPOL_CAP-0603  [C0603]
C8  56p  NONPOL_CAP-0603  [C0603]
C9  100p  NONPOL_CAP-0603  [C0603]
L1  4.7u  INDUCTOR-SPM4020T  [SPM4020T]
PDU1  LTC3112EFE  [TSSOP20CA]
R1  620k  RESISTOR-0603  [R0603]
R2  200k  RESISTOR-0603  [R0603]
R3  9.1k  RESISTOR-0603  [R0603]
R4  42.2k  RESISTOR-0603  [R0603]
R5  39k  RESISTOR-0603  [R0603]
R6  10k  RESISTOR-0603  [R0603]

### Nets
N$1: C3.2 PDU1.17(BST1)
N$2: C2.1 PDU1.18(VCC) PDU1.19(PWM)
N$3: C4.2 PDU1.14(BST2)
N$4: C3.1 L1.1 PDU1.15(SW1) PDU1.16(SW1)
N$5: C7.1 R5.1
N$6: C6.1 C7.2 PDU1.2(COMP)
N$7: C4.1 L1.2 PDU1.12(SW2) PDU1.13(SW2)
N$8: C8.2 R3.2
N$9: C6.2 PDU1.3(FB) R1.1 R2.2 R3.1 R5.2
ON: PDU1.7(RUN) R6.2
REF: C1.2 C2.2 C5.2 C9.1 PDU1.1(GND) PDU1.4(OVP) PDU1.10(GND) PDU1.11(GND) PDU1.20(GND) PDU1.21(GND) R2.1 R4.1 R6.1
SENS: C9.2 PDU1.8(IOUT) R4.2
VIN: C1.1 PDU1.5(VIN) PDU1.6(VIN)
VOUT: C5.1 C8.1 PDU1.9(VOUT) R1.2

### Notes on the sheet
- 1 V/A

### Library data of the parts
C1-C9 = Pasives:NONPOL_CAP
L1 = Pasives:INDUCTOR: SMD Power Inductor
PDU1 = ICs:LTC3112
R1-R6 = Pasives:RESISTOR: RESISTOR

## Module CONTROLLER
Ports: REF(pwr) 5V_IN(pwr) 7.5V_IN(pwr) PV_BUS(in) IS_PV(in) IS_LOAD(in) 5V_PL(in) 3.3V_PL(in) IS_PDU_5V(in) IS_PDU_3.3V(in) VS_BAT1(in) IS_BAT1(in) VS_BAT2(in) SPI_CLK(out) SPI_MOSI(out) !SPI_SS1(out) !SPI_SS2(out) TX(out) RX(in) SPI_MISO(in) IS_BAT2(in)
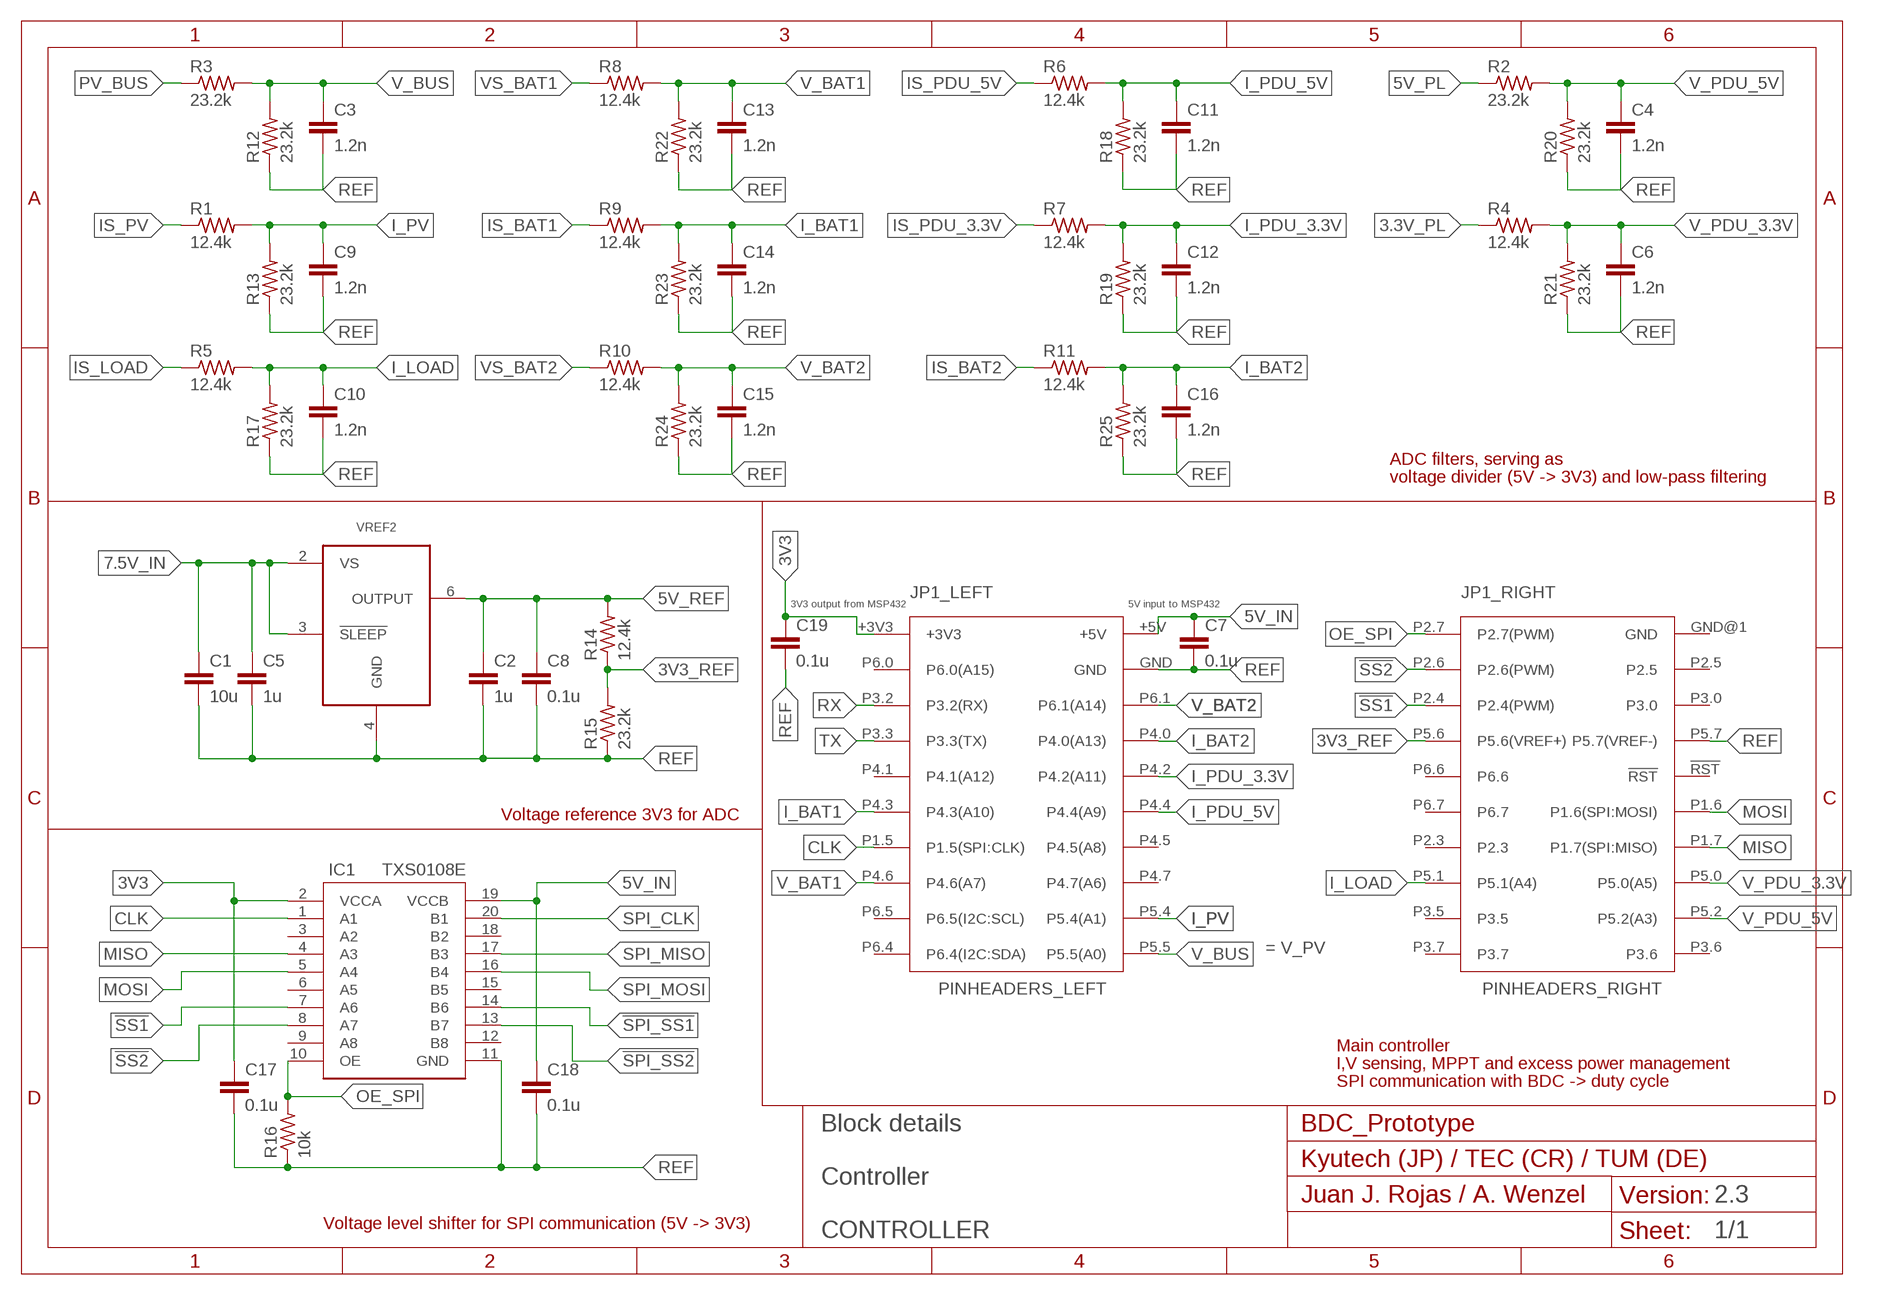
[diagram p7: schematic, module CONTROLLER, sheet 1]
FRAME2 (A4L-JUANJO): SUBTITLE: Controller; TITLE: Block details

### Parts
C1  10u  NONPOL_CAP-0603  [C0603]
C2  1u  NONPOL_CAP-0603  [C0603]
C3  1.2n  NONPOL_CAP-0603  [C0603]
C4  1.2n  NONPOL_CAP-0603  [C0603]
C5  1u  NONPOL_CAP-0603  [C0603]
C6  1.2n  NONPOL_CAP-0603  [C0603]
C7  0.1u  NONPOL_CAP-0603  [C0603]
C8  0.1u  NONPOL_CAP-0603  [C0603]
C9  1.2n  NONPOL_CAP-0603  [C0603]
C10  1.2n  NONPOL_CAP-0603  [C0603]
C11  1.2n  NONPOL_CAP-0603  [C0603]
C12  1.2n  NONPOL_CAP-0603  [C0603]
C13  1.2n  NONPOL_CAP-0603  [C0603]
C14  1.2n  NONPOL_CAP-0603  [C0603]
C15  1.2n  NONPOL_CAP-0603  [C0603]
C16  1.2n  NONPOL_CAP-0603  [C0603]
C17  0.1u  NONPOL_CAP-0603  [C0603]
C18  0.1u  NONPOL_CAP-0603  [C0603]
C19  0.1u  NONPOL_CAP-0603  [C0603]
IC1  TXS0108E  [SOP65P640X120-20]
JP1  BOOSTERPACK_HEADERS  [BOOSTERPACK_HEADERS]
R1  12.4k  RESISTOR-0603  [R0603]
R2  23.2k  RESISTOR-0603  [R0603]
R3  23.2k  RESISTOR-0603  [R0603]
R4  12.4k  RESISTOR-0603  [R0603]
R5  12.4k  RESISTOR-0603  [R0603]
R6  12.4k  RESISTOR-0603  [R0603]
R7  12.4k  RESISTOR-0603  [R0603]
R8  12.4k  RESISTOR-0603  [R0603]
R9  12.4k  RESISTOR-0603  [R0603]
R10  12.4k  RESISTOR-0603  [R0603]
R11  12.4k  RESISTOR-0603  [R0603]
R12  23.2k  RESISTOR-0603  [R0603]
R13  23.2k  RESISTOR-0603  [R0603]
R14  12.4k  RESISTOR-0603  [R0603]
R15  23.2k  RESISTOR-0603  [R0603]
R16  10k  RESISTOR-0603  [R0603]
R17  23.2k  RESISTOR-0603  [R0603]
R18  23.2k  RESISTOR-0603  [R0603]
R19  23.2k  RESISTOR-0603  [R0603]
R20  23.2k  RESISTOR-0603  [R0603]
R21  23.2k  RESISTOR-0603  [R0603]
R22  23.2k  RESISTOR-0603  [R0603]
R23  23.2k  RESISTOR-0603  [R0603]
R24  23.2k  RESISTOR-0603  [R0603]
R25  23.2k  RESISTOR-0603  [R0603]
VREF2  REF195GSZ  [SOIC-8]

### Nets
3.3V_PL: R4.1
3V3: C17.1 C19.1 IC1.2(VCCA) JP1.+3V3(_LEFT:+3V3)
3V3_REF: JP1.P5.6(_RIGHT:P5.6(VREF+)) R14.1 R15.2
5V_IN: C7.1 C18.1 IC1.19(VCCB) JP1.+5V(_LEFT:+5V)
5V_PL: R2.1
5V_REF: C2.1 C8.1 R14.2 VREF2.6(OUTPUT)
7.5V_IN: C1.1 C5.1 VREF2.2(VS) VREF2.3(!SLEEP!)
!SPI_SS1: IC1.14(B6)
!SPI_SS2: IC1.13(B7)
!SS1: IC1.7(A6) JP1.P2.4(_RIGHT:P2.4(PWM))
!SS2: IC1.8(A7) JP1.P2.6(_RIGHT:P2.6(PWM))
CLK: IC1.1(A1) JP1.P1.5(_LEFT:P1.5(SPI:CLK))
I_BAT1: C14.1 JP1.P4.3(_LEFT:P4.3(A10)) R9.2 R23.2
I_BAT2: C16.1 JP1.P4.0(_LEFT:P4.0(A13)) R11.2 R25.2
I_LOAD: C10.1 JP1.P5.1(_RIGHT:P5.1(A4)) R5.2 R17.2
I_PDU_3.3V: C12.1 JP1.P4.2(_LEFT:P4.2(A11)) R7.2 R19.2
I_PDU_5V: C11.1 JP1.P4.4(_LEFT:P4.4(A9)) R6.2 R18.2
I_PV: C9.1 JP1.P5.4(_LEFT:P5.4(A1)) R1.2 R13.2
IS_BAT1: R9.1
IS_BAT2: R11.1
IS_LOAD: R5.1
IS_PDU_3.3V: R7.1
IS_PDU_5V: R6.1
IS_PV: R1.1
MISO: IC1.4(A3) JP1.P1.7(_RIGHT:P1.7(SPI:MISO))
MOSI: IC1.5(A4) JP1.P1.6(_RIGHT:P1.6(SPI:MOSI))
OE_SPI: IC1.10(OE) JP1.P2.7(_RIGHT:P2.7(PWM)) R16.2
PV_BUS: R3.1
REF: C1.2 C2.2 C3.2 C4.2 C5.2 C6.2 C7.2 C8.2 C9.2 C10.2 C11.2 C12.2 C13.2 C14.2 C15.2 C16.2 C17.2 C18.2 C19.2 IC1.11(GND) JP1.GND(_LEFT:GND) JP1.P5.7(_RIGHT:P5.7(VREF-)) R12.1 R13.1 R15.1 R16.1 R17.1 R18.1 R19.1 R20.1 R21.1 R22.1 R23.1 R24.1 R25.1 VREF2.4(GND)
RX: JP1.P3.2(_LEFT:P3.2(RX))
SPI_CLK: IC1.20(B1)
SPI_MISO: IC1.17(B3)
SPI_MOSI: IC1.16(B4)
TX: JP1.P3.3(_LEFT:P3.3(TX))
V_BAT1: C13.1 JP1.P4.6(_LEFT:P4.6(A7)) R8.2 R22.2
V_BAT2: C15.1 JP1.P6.1(_LEFT:P6.1(A14)) R10.2 R24.2
V_BUS: C3.1 JP1.P5.5(_LEFT:P5.5(A0)) R3.2 R12.2
V_PDU_3.3V: C6.1 JP1.P5.0(_RIGHT:P5.0(A5)) R4.2 R21.2
V_PDU_5V: C4.1 JP1.P5.2(_RIGHT:P5.2(A3)) R2.2 R20.2
VS_BAT1: R8.1
VS_BAT2: R10.1
Unconnected: IC1.3(A2) IC1.6(A5) IC1.9(A8) IC1.12(B8) IC1.15(B5) IC1.18(B2) JP1.!RST(_RIGHT:!RST) JP1.GND@1(_RIGHT:GND) JP1.P2.3(_RIGHT:P2.3) JP1.P2.5(_RIGHT:P2.5) JP1.P3.0(_RIGHT:P3.0) JP1.P3.5(_RIGHT:P3.5) JP1.P3.6(_RIGHT:P3.6) JP1.P3.7(_RIGHT:P3.7) JP1.P4.1(_LEFT:P4.1(A12)) JP1.P4.5(_LEFT:P4.5(A8)) JP1.P4.7(_LEFT:P4.7(A6)) JP1.P6.0(_LEFT:P6.0(A15)) JP1.P6.4(_LEFT:P6.4(I2C:SDA)) JP1.P6.5(_LEFT:P6.5(I2C:SCL)) JP1.P6.6(_RIGHT:P6.6) JP1.P6.7(_RIGHT:P6.7)

### Notes on the sheet
- ADC filters, serving as
- voltage divider (5V -> 3V3) and low-pass filtering
- 3V3 output from MSP432 | 5V input to MSP432
- Voltage reference 3V3 for ADC
- = V_PV
- Main controller
- I,V sensing, MPPT and excess power management
- SPI communication with BDC -> duty cycle
- Voltage level shifter for SPI communication (5V -> 3V3)

### Library data of the parts
C1-C19 = Pasives:NONPOL_CAP
IC1 = TI_LevelShifter:TXS0108E: TXS0108E
JP1 = MSP432_aux:BOOSTERPACK_HEADERS: BoosterPack Pin Headers BoosterPack pin headers (left, right and bottom) of MSP432 LaunchPad Development Kit. Serves to connect the MSP432 microcontroller of the LaunchPad via its BoosterPack breakout pins to another circuit board, thus make use of the MSP432 via its LaunchPad. Source: MSP432_aux.lbr
R1-R25 = Pasives:RESISTOR: RESISTOR
VREF2 = ICs:REF195GSZ